# EAGLE design sidecar (EAGLE 9.4.0)
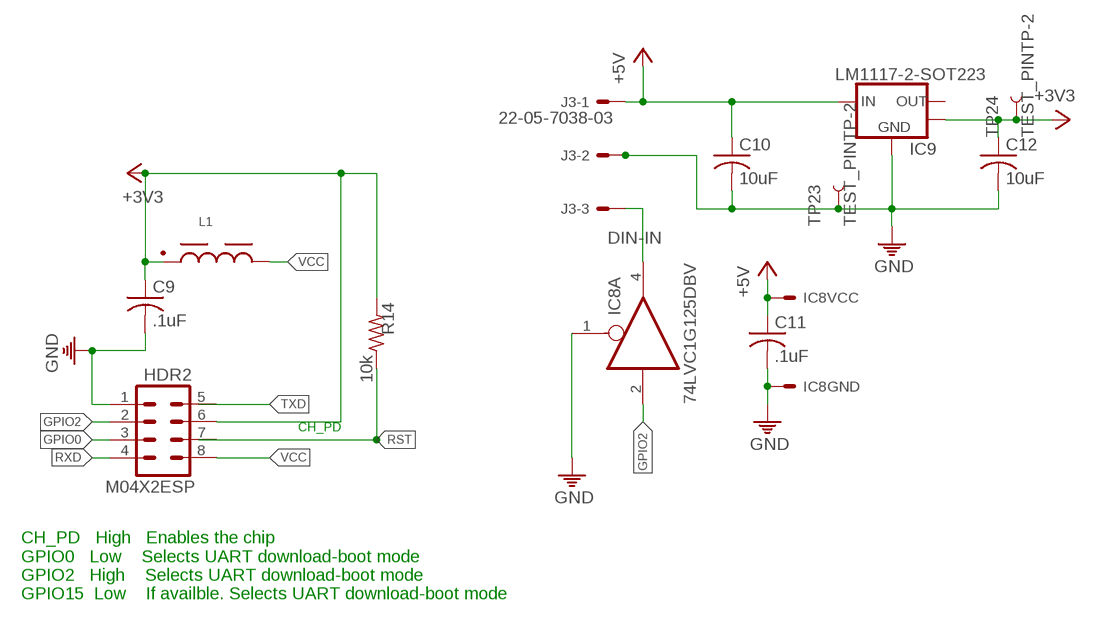
[diagram p0: schematic, sheet 1]

## Parts
C9  .1uF  C-USC0805  [C0805]
C10  10uF  C-USC0805  [C0805]
C11  .1uF  C-USC0805  [C0805]
C12  10uF  C-USC0805  [C0805]
HDR2  M04X2ESP  [2X4-ESP]
IC8  74LVC1G125DBV  [SOT23-5]
IC9  LM1117-2-SOT223  [SOT-223-3]
J3  22-05-7038-03  [7395-03]
L1  WE-CBA_0805_782851102_WB/HS  [WE-CBA_0805(W=3)]
R14  10k  R-US_R0805  [R0805]
TP23  TEST_PINTP-2  [TP-2]
TP24  TEST_PINTP-2  [TP-2]

## Nets
+3V3: C9.1 C12.1 HDR2.6 IC9.4(HEATSINK) L1.1 R14.2 TP24.P$1
+5V: C10.1 C11.1 IC8.5(VCC:S) IC9.3(VIN) J3.1
DIN-IN: IC8.4(A:O) J3.3
GND: C9.2 C10.2 C11.2 C12.2 HDR2.1 IC8.1(A:OE) IC8.3(GND:S) IC9.1(GND) J3.2 TP23.P$1
GPIO0: HDR2.3
GPIO2: HDR2.2 IC8.2(A:I)
RST: HDR2.7 R14.1
RXD: HDR2.4
TXD: HDR2.5
VCC: HDR2.8 L1.2
Unconnected: IC9.2(VOUT)

## Notes on the sheet
- CH_PD
- CH_PD   High   Enables the chip
  GPIO0   Low    Selects UART download-boot mode
  GPIO2   High    Selects UART download-boot mode
  GPIO15  Low    If availble. Selects UART download-boot mode

## Library data of the parts
C9-C12 = rcl:C-US: CAPACITOR, American symbol; SPICEPREFIX: C
HDR2 = headers:M04X2ESP
IC8 = logic:74*1G125: Single Bus Buffer Gate with 3-State Output
IC9 = regulators:LM1117-2: LDO Voltage Regulator NCP1117 series are low dropout positive voltage regulators that are capable of providing an output current that is in excess of 1.0 A with a maximum dropout voltage of 1.2 V at 800 mA over temperature. This series contains nine fixed output voltages of 1.5 V, 1.8 V, 1.9 V, 2.0 V, 2.5 V, 2.85 V, 3.3 V, 5.0 V, and 12 V that have no minimum load requirement to maintain regulation. Also included is an adjustable output version that can be programmed from 1.25 V to 18.8 V with two external resistors. datasheet.pdf <http://www.onsemi.com/pub_link/Collateral/NCP1117-D.PDF> LM1117-N is a series of low dropout voltage regulators of 1.2V at 800mA of load current. It has the same pin-out as Texas Instruments' industry standard LM317. The LM1117-N is available in an adjustable version, available in five fixed voltages, 1.8V, 2.5V, 2.85V, 3.3V, and 5V. The LM1117-N offers current limiting and thermal shutdown. Its circuit includes a zener trimmed to within ±1%. datasheet.pdf <http://www.ti.com/lit/ds/symlink/lm1117-n.pdf>
J3 = headers:22-?-03: CONNECTOR wire to board 2.54 mm (.1 inch) pitch header; MF: MOLEX; OC_FARNELL: unknown; OC_NEWARK: unknown
L1 = Wurth_Elektronik_Passive_rev19b:WE-CBA_0805: WE-CBA SMD EMI Suppression Ferrite Bead Characteristics Reliable Ni-Sn electrodes High rated current up to 5A Recommended soldering: Reflow Operating temperature: -55°C to +125°C Applications * Perfect as data line filter and for uncoupling of distribution voltage *This special SMD chip bead ferrites can be put directly on the printed circuit board. They offer excellent anti-EMI properties and low DC-resistance. Placed very close next to the interference source even with smallest size 0402,maximal impedance at 1000 Ω can be reached. *High Speed: "High Speed " SMD ferrites WE-CBF have lower impedance in the lower frequency ranges thus they have only a low attenuation for fast signals. Application e.g. USB 2.0, IEEE 1394,LVDS *Wide Band: "Wide Band" SMD ferrites WE-CBF already show high impedance in low frequency range. Therefore they are wide band through the whole spectrum. Application e.g. control signats, RS232, RS422, DC/DC converter *High Current: "High Current " SMD ferrites WE-CBF are designed for high current (over 1 A). The rated current refers to 40K self-heating. High current SMD ferrites are available in all there types (High Speed, Wide Band and High Frequency). Application e.g. power supply, DC/DC converter *Advice: Pay attention for the use of SMD-Ferrites for high current>1A and ambient temperature over +85°C that the rated current has to be reduced when temperature is above +85°C (Derating). *At+100°C environment temperature the maximal rated current has to add up to only 60% of the data sheet value ,without an overload of the component. Variant abbreviation WB means WIDE BAND HS means HIGH SPEED HC means HIGH CURRENT <http://katalog.we-online.de/media/images/v2/Family_WE-CBA.jpg> Details see: http://katalog.we-online.de/en/pbs/WE-CBA/ Created: 2015-02-02 2015 (C) Wurth Elektronik
R14 = rcl:R-US_: RESISTOR, American symbol; SPICEPREFIX: R
TP23 TP24 = headers:TEST_PIN

## Net classes
0 default: width 0.203 mm, clearance 0.205 mm
1 vcc: width 0.305 mm
2 +V: width 0.813 mm
3 +5V: width 0.406 mm

## Board
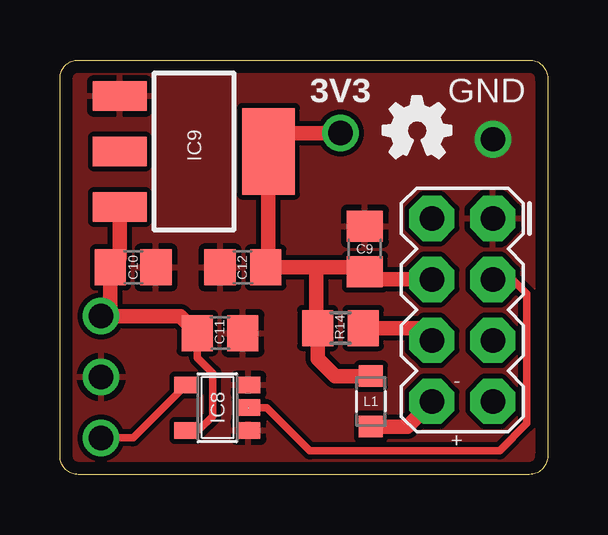
[diagram p1: board, top side]
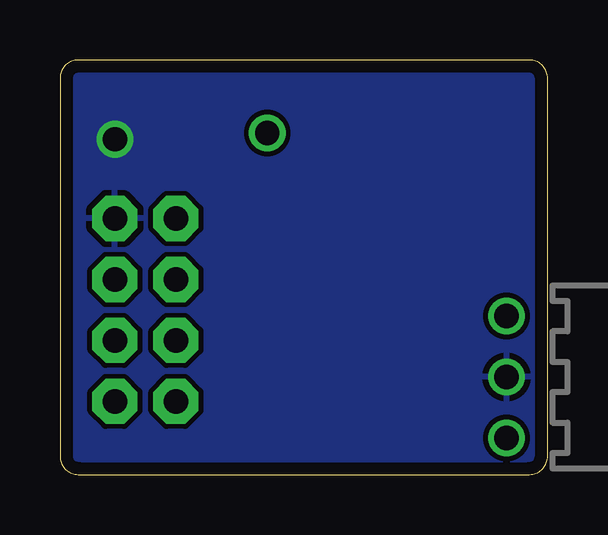
[diagram p2: board, bottom side, seen from below]

Size 20.32 x 17.27 mm. Coordinates in mm from the lower left corner, seen from the top.
Outline: 19.56,0 0.76,0 arc-90 0,0.76 0,16.51 arc-90 0.76,17.27 19.56,17.27 arc-90 20.32,16.51 20.32,0.76 arc-90 19.56,0
Copper layers (1*16): Top 0.035mm / dielectric 1.6mm / Bottom 0.035mm
Design rules "Elecrow_2-layer_PCB_eagle_rule": minimum track width 6mil, minimum drill 12mil, track to track 6mil, track to pad 6mil, pad to pad 6mil, via to via 8mil, smd to smd 0mil, copper to edge 20mil, drill to drill 10mil, minimum pad ring 6mil, minimum via ring 6mil, stop-mask expansion 0mil, vias tented up to drill 100mil, thermal gap 10mil

### Footprints (pad centres in the part's own frame; a part is rotated, then mirrored left to right if it is on the bottom)
C0805 = smd 1.3 x 1.5: 1 -0.95,0; 2 0.95,0
2X4-ESP = drill 1.016 pad 1.88 octagon: 1 -3.81,1.27; 2 -1.27,1.27; 3 1.27,1.27; 4 3.81,1.27; 5 -3.81,-1.27; 6 -1.27,-1.27; 7 1.27,-1.27; 8 3.81,-1.27
SOT23-5 = smd 0.69 x 0.99: 1 -0.95,-1.29; 2 0,-1.29; 3 0.95,-1.29; 4 0.95,1.3; 5 -0.95,1.3
SOT-223-3 = smd 1.219 x 2.235: 1 -2.311,-3.099; 2 0,-3.099; 3 2.311,-3.099 | smd 3.6 x 2.2: 4 0,3.099
7395-03 = drill 1.016: 1 2.54,0; 2 0,0; 3 -2.54,0
WE-CBA_0805(W=3) = smd 0.9 x 1: 1 -1.05,0; 2 1.05,0
R0805 = smd 1.3 x 1.5: 1 -0.95,0; 2 0.95,0
TP-2 = drill 1.016 pad 1.143: P$1 0,0

### Placement (x,y rotation side)
C9  12.7,9.4 90 top
C10  3.05,8.64 0 top
C11  6.67,5.89 0 top
C12  7.62,8.64 180 top
HDR2  16.76,6.86 270 top
IC8  6.56,2.79 90 top
IC9  5.59,13.46 270 top
J3  1.71,4.06 90 bottom
L1  12.95,3.05 270 top
R14  11.68,6.1 180 top
TP23  18.03,13.97 0 top
TP24  11.68,14.22 0 top
U$8  [OSHW_FILLX100_NOTEXT]  13.46,13.21 0 top

### Tracks (layer width: path | path; a pad name or v marks a point on that pad's centre or on a via)
+3V3
  Top 0.61: TP24.P$1 9.45,14.22 IC9.4 8.69,8.75 C12.1 10.67,8.64 | 10.67,8.64 12.51,8.64 C9.1 13.02,8.13 HDR2.6 | 10.67,8.64 10.67,6.16 R14.2 10.73,4.83 11.46,4.1 L1.1
+5V
  Top 0.305: C11.1 5.72,4.87 6.37,4.23 6.37,2.43 5.77,1.84 IC8.5
  Top 0.61: IC9.3 2.49,9.03 C10.1 2.1,6.99 J3.1 5.01,6.6 C11.1
DIN-IN
  Top 0.305: IC8.4 3.05,1.52 J3.3
GND
  pour Bottom: 0.03,17.29 20.28,17.29 20.28,-0.06 0.03,-0.06
  pour Top: 0.03,-0.06 20.28,-0.06 20.28,17.29 0.03,17.29
GPIO2
  Top 0.305: IC8.2 8.61,2.79 10.41,0.99 18.32,0.99 19.46,2.13 19.46,7.52 18.85,8.13 HDR2.2
RST
  Top 0.61: R14.1 14.99,6.1 HDR2.7
VCC
  Top 0.61: L1.2 14.48,2 15.49,3.01 HDR2.8

### Text on the board
tPlace: 3V3 | GND | - | +